# EAGLE design PowerBoard (EAGLE 9.2.2)

## Sheet 1 of 3
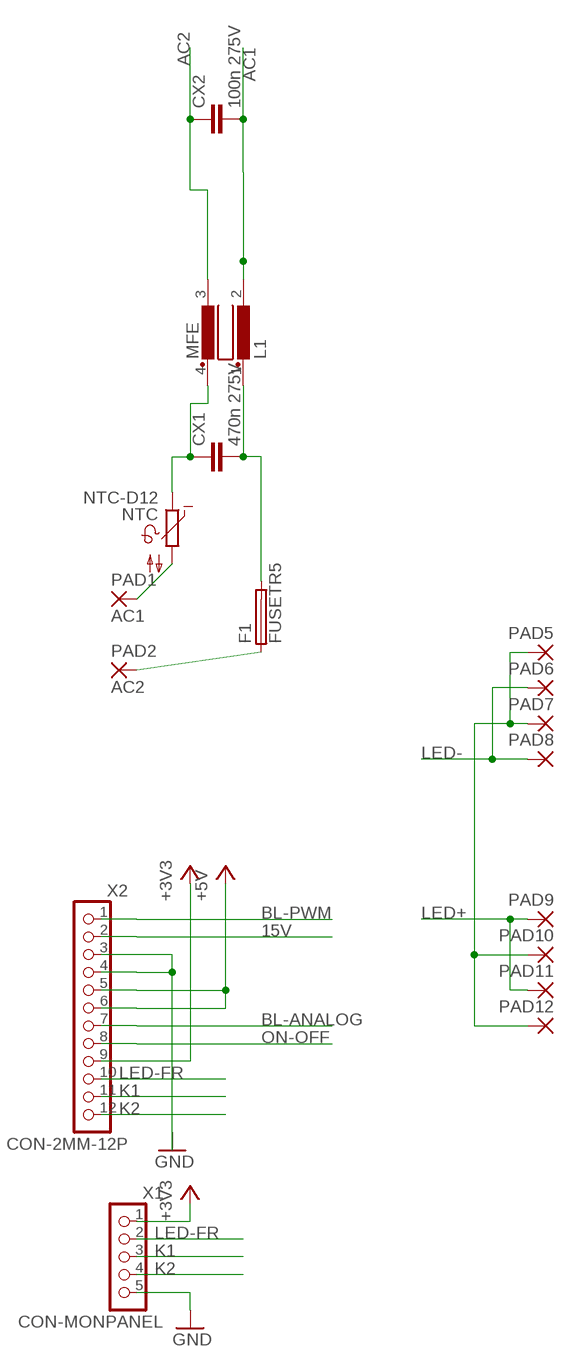
[diagram p0: schematic, sheet 1]

### Parts
CX1  470n 275V  CXXC15B10  [XC15B10]
CX2  100n 275V  CXXC15B6  [XC15B6]
F1  FUSETR5  [TR5]
L1  MFE  [MFE]
NTC  NTC-D12  [NTC-D12]
PAD1  AC1  WIREPAD3,81/1,4  [3,81/1,4]
PAD2  AC2  WIREPAD3,81/1,4  [3,81/1,4]
PAD5  2,54/1,1  [2,54/1,1]
PAD6  2,54/1,1  [2,54/1,1]
PAD7  2,54/1,1  [2,54/1,1]
PAD8  2,54/1,1  [2,54/1,1]
PAD9  2,54/1,1  [2,54/1,1]
PAD10  2,54/1,1  [2,54/1,1]
PAD11  2,54/1,1  [2,54/1,1]
PAD12  2,54/1,1  [2,54/1,1]
X1  CON-MONPANEL  [CON-5-PANEL]
X2  CON-2MM-12P  [CON-12-2MM]

### Nets
15V: X2.2
+3V3: X1.1 X2.9
+5V: X2.5 X2.6 ; also sheet 3
AC1: CX2.2 L1.2 ; also sheet 2,3
AC2: CX2.1 L1.3 ; also sheet 2,3
BL-ANALOG: X2.7
BL-PWM: X2.1 ; also sheet 2
GND: X1.5 X2.3 X2.4 ; also sheet 2,3
K1: X1.3 X2.11
K2: X1.4 X2.12
LED+: PAD9.1(P) PAD11.1(P) ; also sheet 2
LED-: PAD6.1(P) PAD8.1(P) ; also sheet 2
LED-FR: X1.2 X2.10
N$3: PAD5.1(P) PAD7.1(P) PAD10.1(P) PAD12.1(P)
N$12: NTC.2 PAD1.1(P)
N$20: F1.1 PAD2.1(P)
N$35: CX1.1 L1.4 NTC.1
N$36: CX1.2 F1.2 L1.1
ON-OFF: X2.8 ; also sheet 2

## Sheet 2 of 3
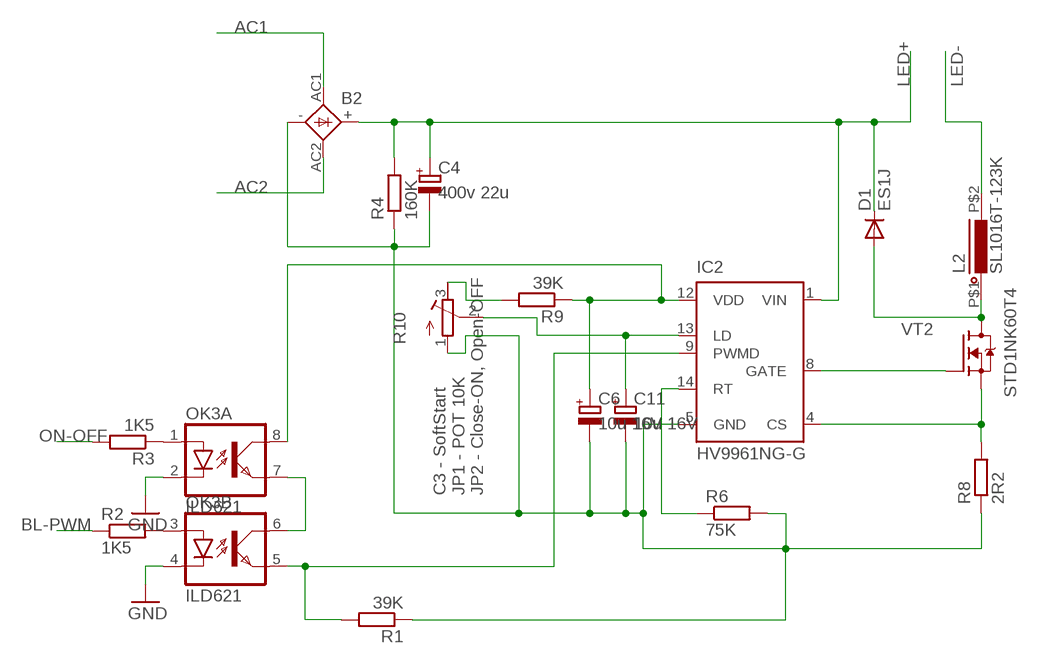
[diagram p1: schematic, sheet 2]

### Parts
B2  BRIDGEDBS  [DBS]
C4  400v 22u  CAP-POL_E5-13,5  [E5-13,5]
C6  10u 16V  CAP-POL_E2.5-7  [E2,5-7]
C11  10u 16V  CAP-POL_E2.5-7  [E2,5-7]
D1  ES1J  DIODE_ES1J  [DO214AC]
IC2  HV9961NG-G  HV9910BNG  [SOIC-16NG]
L2  SL1016T-123K  INDUCTORSL1016  [SL1016]
OK3  ILD621  [DIL08]
R1  39K  R_R0805  [RESC2012X50]
R2  1K5  R_R0805  [RESC2012X50]
R3  1K5  R_R0805  [RESC2012X50]
R4  160K  R_MF-0125  [MF-0125]
R6  75K  R_R0805  [RESC2012X50]
R8  2R2  R_MF-05  [MF-05]
R9  39K  R_R0805  [RESC2012X50]
R10  R_POT3296X  [POT-3296X]
VT2  STD1NK60T4  FET-NDPAK  [DPAK]

### Nets
AC1: B2.AC1 ; also sheet 1,3
AC2: B2.AC2 ; also sheet 1,3
BL-PWM: R2.1 ; also sheet 1
GND: OK3.2(A:C) OK3.4(B:C) ; also sheet 1,3
LED+: B2.+ C4.+ D1.C IC2.1(VIN) R4.2 ; also sheet 1
LED-: L2.P$2 ; also sheet 1
N$6: OK3.6(B:COL) OK3.7(A:EMIT)
N$7: IC2.9(PWMD) OK3.5(B:EMIT) R1.2
N$8: OK3.1(A:A) R3.1
N$9: OK3.3(B:A) R2.2
N$10: IC2.14(RT) R6.1
N$11: IC2.8(GATE) VT2.1(G)
N$18: D1.A L2.P$1 VT2.2(PAD)(D)
N$24: IC2.4(CS) R8.2 VT2.3(S)
N$25: B2.- C4.- C6.- C11.- IC2.5(GND) R1.1 R4.1 R6.2 R8.1 R10.1(A)
N$26: C11.+ IC2.13(LD) R10.2(S)
N$27: R9.2 R10.3(E)
N$29: C6.+ IC2.12(VDD) OK3.8(A:COL) R9.1
ON-OFF: R3.2 ; also sheet 1

### Notes on the sheet
- C3 - SoftStart
  JP1 - POT 10K
  JP2 - Close-ON, Open-OFF

## Sheet 3 of 3
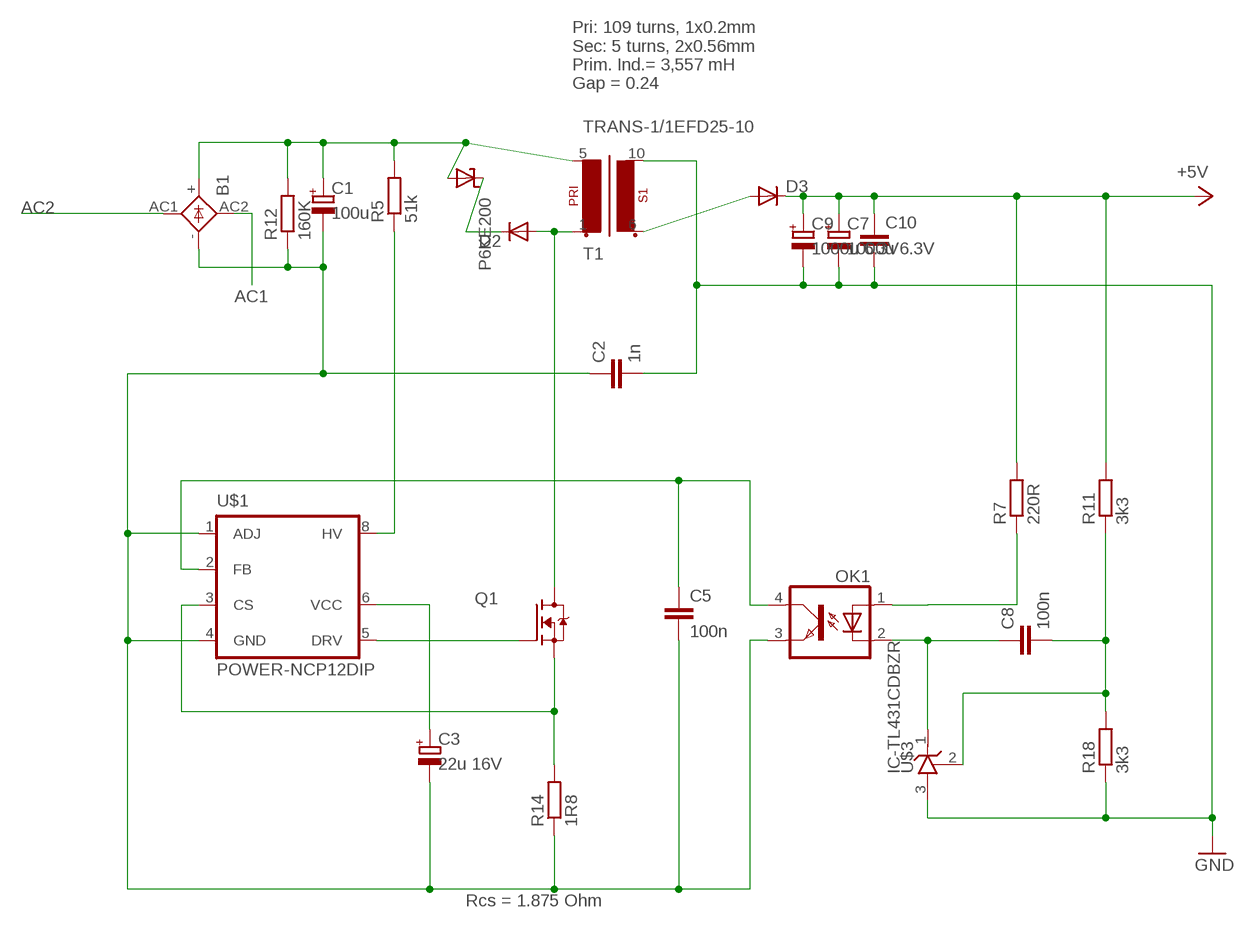
[diagram p2: schematic, sheet 3]

### Parts
B1  KBL  [KBL]
C1  100u  CAP-POL_E5-13-35-H  [E5-13-35-HORIZ]
C2  1n  CAP_C50-024X044  [C050-024X044]
C3  22u 16V  CAP-POL_E2.5-7  [E2,5-7]
C5  100n  CAP_1206  [CAP1206]
C7  1000u 6.3V  CAP-POL_E3.5-8  [E3,5-8]
C8  100n  CAP_1206  [CAP1206]
C9  1000u 6.3V  CAP-POL_E3.5-8  [E3,5-8]
C10  CAP_0805  [CAP0805]
D2  DIODE_ES1J  [DO214AC]
D3  DIODE_TO-220-2  [TO220ACS]
OK1  OPTOTRANSPC817  [DIL04]
P6KE200  SUPRESSORDO-204AC  [DO15-12]
Q1  FET-NTO-220  [TO-220V]
R5  51k  R_SQP-5  [SQP-5]
R7  220R  R_R1206  [RESC3216X60]
R11  3k3  R_R1206  [RESC3216X60]
R12  160K  R_MF-0125  [MF-0125]
R14  1R8  R_MF-025  [MF-025]
R18  3k3  R_R1206  [RESC3216X60]
T1  TRANS-1/1EFD25-10  [EFD25_10PIN]
U$1  POWER-NCP12DIP  [DIP-8]
U$3  IC-TL431CDBZR  [SOT95P240X115-3]

### Nets
+5V: C7.+ C9.+ C10.1 D3.C R7.2 R11.2 ; also sheet 1
AC1: B1.AC2(AC1) ; also sheet 1,2
AC2: B1.AC1(AC2) ; also sheet 1,2
GND: C2.2 C7.- C9.- C10.2 R18.1 T1.10(S1-2) U$3.3(A) ; also sheet 1,2
N$13: B1.+ C1.+ P6KE200.A R5.2 R12.2 T1.5(P1-2)
N$14: D2.A Q1.2(D) T1.1(P1-1)
N$15: R5.1 U$1.8(HV)
N$16: C3.+ U$1.6(VCC)
N$17: C5.1 OK1.4(COL) U$1.2(FB)
N$19: D2.C P6KE200.C
N$21: OK1.1(A) R7.1
N$22: Q1.1(G) U$1.5(DRV)
N$23: C8.2 R11.1 R18.2 U$3.2(R)
N$30: B1.- C1.- C2.1 C3.- C5.2 OK1.3(EMIT) R12.1 R14.1 U$1.1(ADJ) U$1.4(GND)
N$31: C8.1 OK1.2(C) U$3.1(C)
N$33: Q1.3(S) R14.2 U$1.3(CS)
N$41: D3.A T1.6(S1-1)

### Notes on the sheet
- Pri: 109 turns, 1x0.2mm
  Sec: 5 turns, 2x0.56mm
  Prim. Ind.= 3,557 mH
  Gap = 0.24
- Rcs = 1.875 Ohm

## Library data of the parts
B1 = rectifier:KBL: DIOTEC RECTIFIER
B2 = Flamberm:BRIDGE: GENERAL INSTRUMENT RECTIFIER
C1 C3 C4 C6 C7 C9 C11 = Flamberm:CAP-POL_
C2 C5 C8 C10 = Flamberm:CAP_
CX1 CX2 = rcl:CX: X CAPACITOR for power line; SPICEPREFIX: C
D1-D3 = Flamberm:DIODE_
F1 = fuse:FUSE: Fuse; OC_FARNELL: unknown; OC_NEWARK: unknown
IC2 = Flamberm:HV9910B: Universal High Brightness LED Driver Source: www.supertex.com .. led_driver_ics_SG.pdf; OC_FARNELL: unknown; OC_NEWARK: unknown
L1 = inductors:MFE: FILTER
L2 = Flamberm:INDUCTOR
NTC = Flamberm:NTC-D12
OK1 = Flamberm:OPTOTRANS: SHARP OPTO COUPLER; MPN: PC817X4J000F; OC_FARNELL: 9707727; OC_NEWARK: 97K7059
OK3 = optocoupler:ILD621: SIEMENS OPTO COUPLER; MF: VISHAY/TELEFUNKEN; MPN: ILD621; OC_FARNELL: 1020151; OC_NEWARK: 58K1678
P6KE200 = Flamberm:SUPRESSOR
PAD1 PAD2 = wirepad:WIREPAD: Wire PAD connect wire on PCB
PAD5-PAD12 = wirepad:2,54/1,1: THROUGH-HOLE PAD
Q1 VT2 = Flamberm:FET-N
R1-R9 R11 R12 R14 R18 = Flamberm:R_
R10 = Flamberm:R_POT
T1 = Flamberm:TRANS-1/1
U$1 = Flamberm:POWER-NCP12*
U$3 = Flamberm:IC-TL431
X1 = Flamberm:CON-MONPANEL
X2 = Flamberm:CON-2MM-12P

## Board
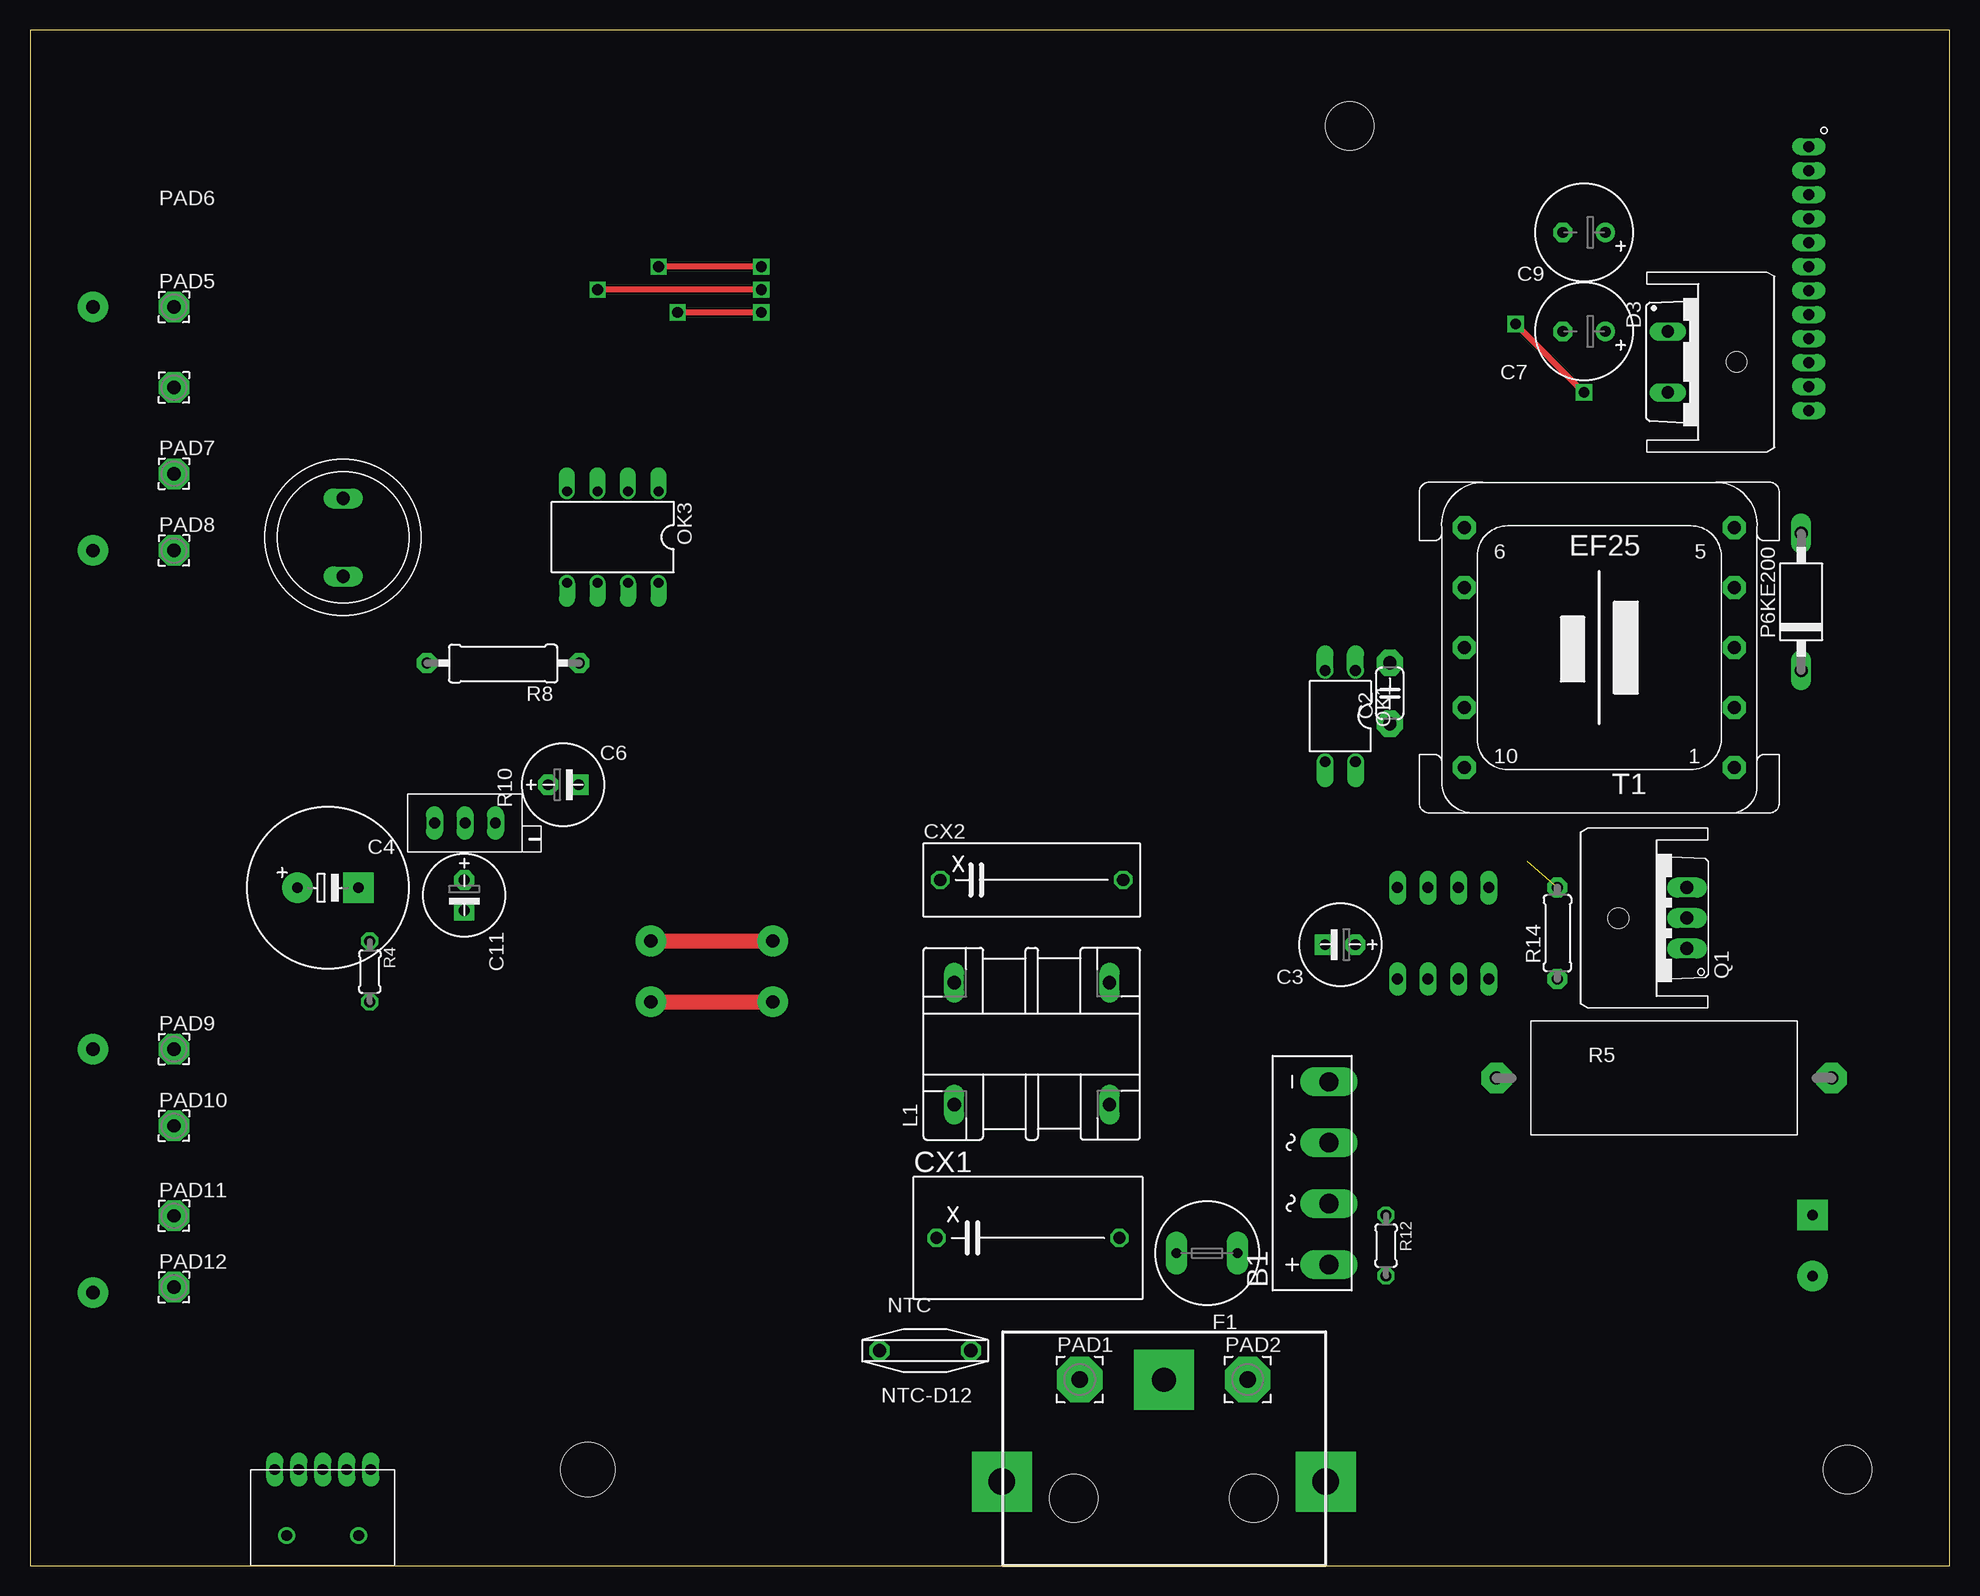
[diagram p3: board, top side]
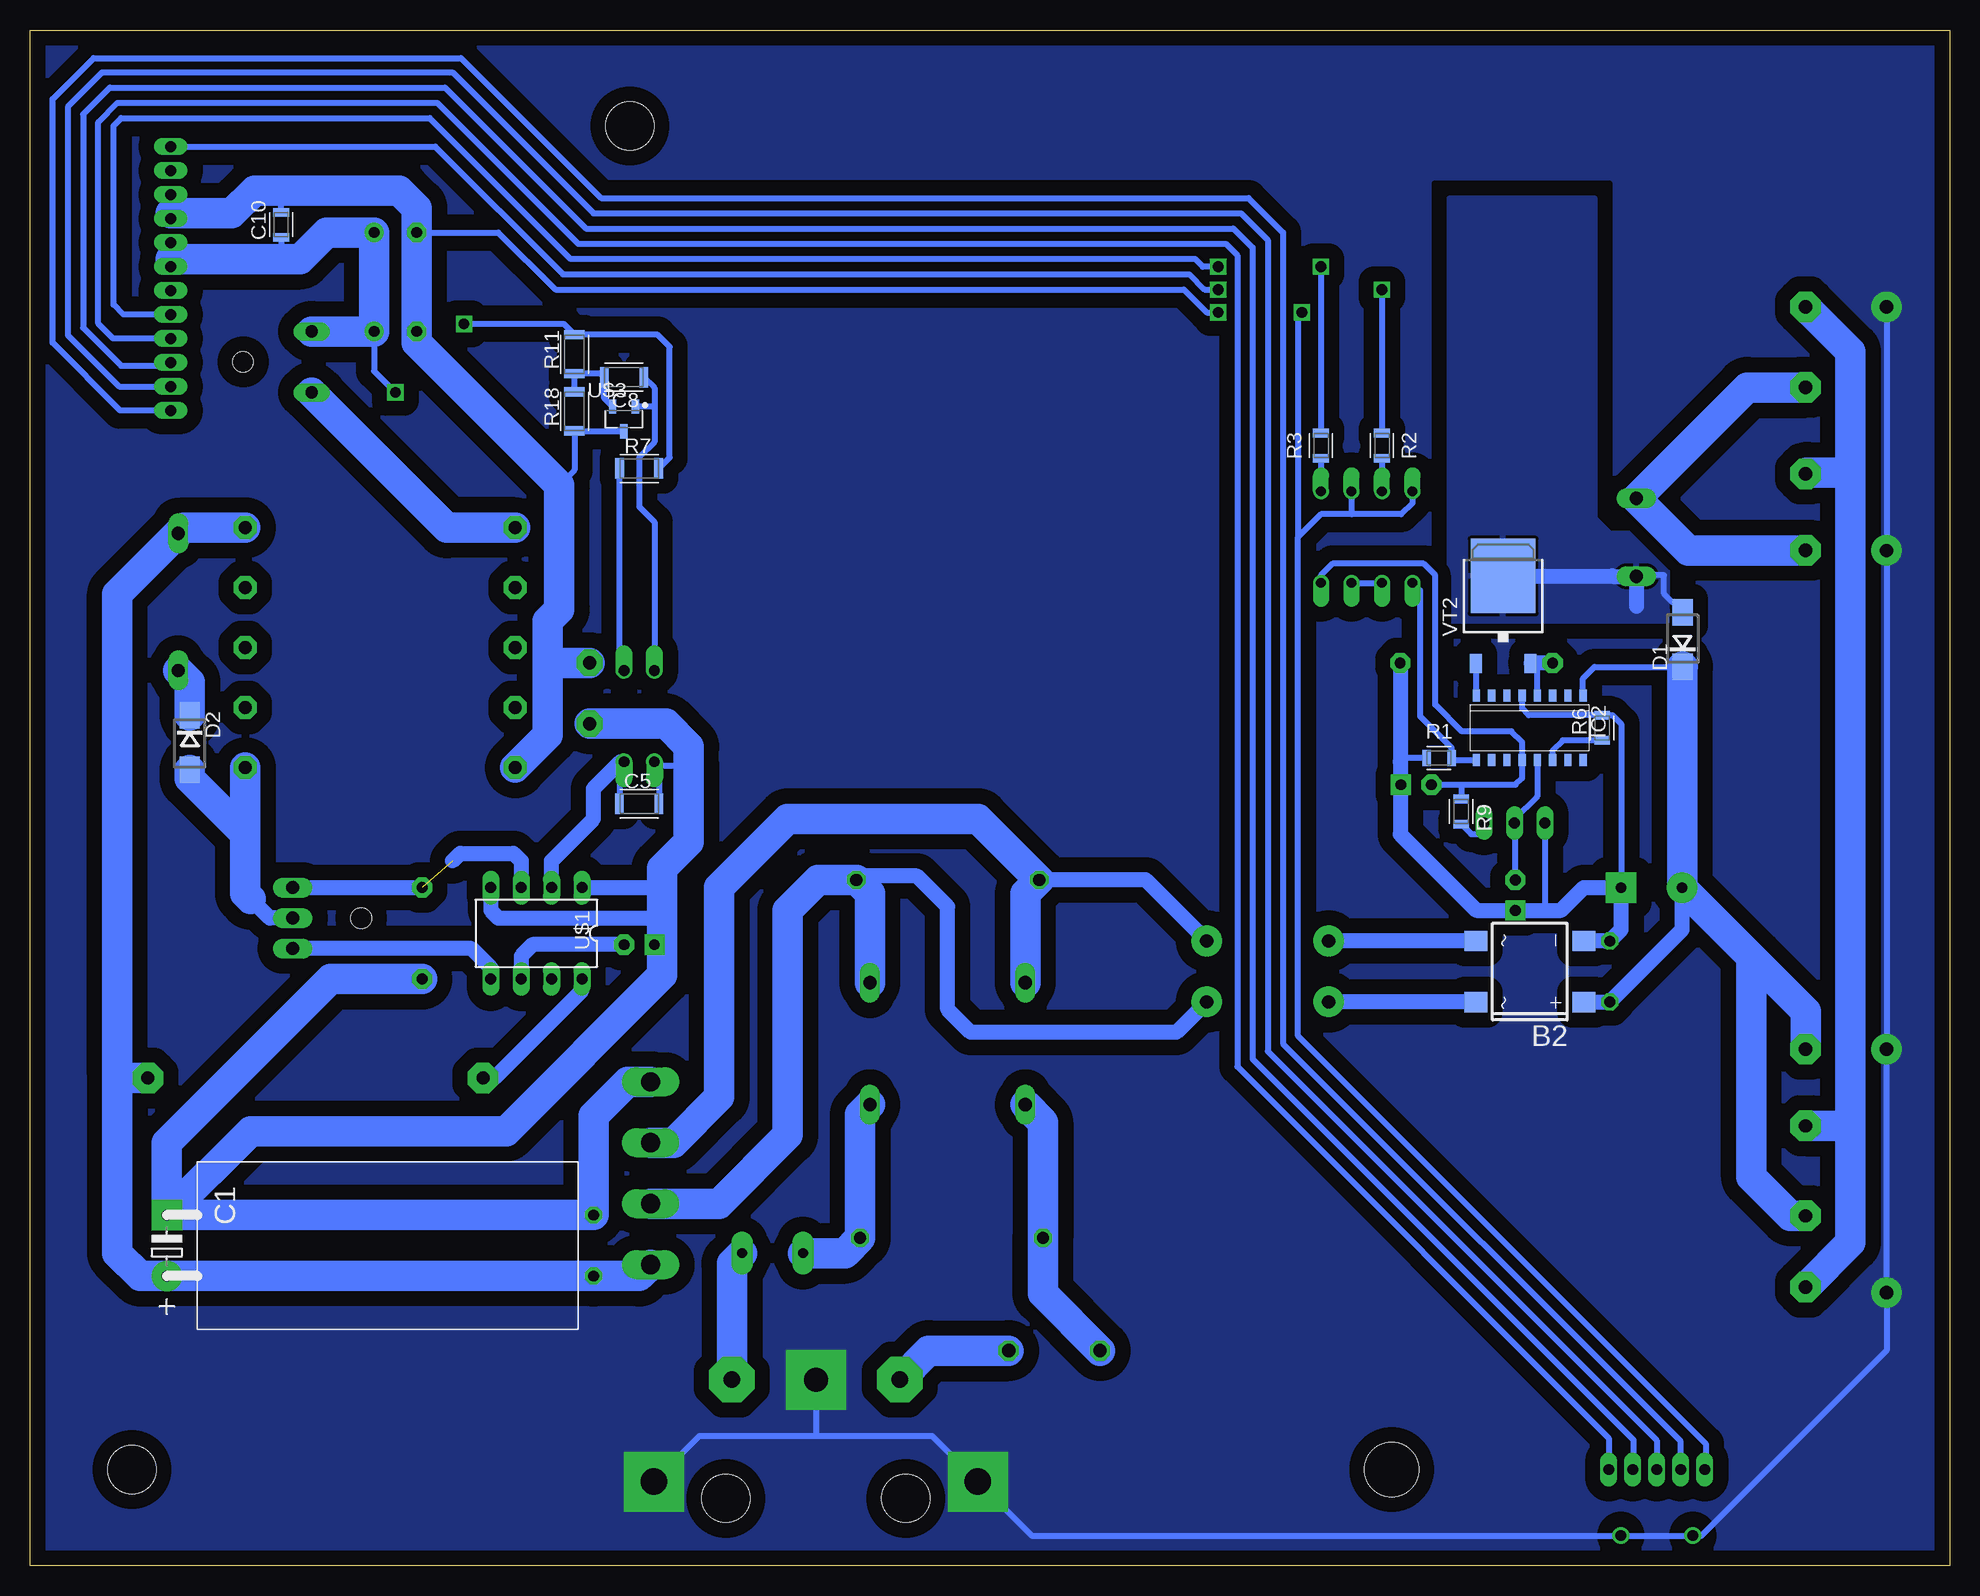
[diagram p4: board, bottom side, seen from below]

Size 160 x 128 mm. Coordinates in mm from the lower left corner, seen from the top.
Outline: 0,0 160,0 160,128 0,128 0,0
Copper layers (1*16): Top 0.035mm / dielectric 1.5mm / Bottom 0.035mm
Design rules "EagleDesignRules": minimum track width 0.25mm, minimum drill 0.3mm, track to track 0.25mm, track to pad 0.25mm, pad to pad 0.25mm, via to via 0.25mm, smd to smd 0.25mm, copper to edge 0.5mm, drill to drill 0.5mm, minimum pad ring 10mil, minimum via ring 8mil, stop-mask expansion 4mil, vias tented up to drill 0mil, thermal gap 0.25mm
Holes 4.5 mm at 46.5,8
Holes 4 mm at 151.5,8 110,120 87,5.6 102,5.6

### Footprints (pad centres in the part's own frame; a part is rotated, then mirrored left to right if it is on the bottom)
KBL = drill 1.6 long: + -7.62,-1.27; - 7.62,-1.27; AC1 2.54,-1.27; AC2 -2.54,-1.27
DBS = smd 1.7 x 1.9: + -2.55,-4.5; - 2.55,-4.5; AC1 -2.55,4.5; AC2 2.55,4.5
E5-13-35-HORIZ = drill 0.9 pad 2.54: + -2.54,0 | drill 0.9 pad 2.54 square: - 2.54,0
C050-024X044 = drill 1.1 pad 2.184 octagon: 1 -2.54,0; 2 2.54,0
E2,5-7 = drill 0.9 pad 1.676 octagon: + -1.27,0 | drill 0.9 pad 1.676 square: - 1.27,0
E5-13,5 = drill 0.9 pad 2.54: + -2.54,0 | drill 0.9 pad 2.54 square: - 2.54,0
CAP1206 = smd 0.712 x 1.712: 1 -1.65,0; 2 1.65,0
E3,5-8 = drill 0.9 pad 1.6: + -1.778,0 | drill 0.9 pad 1.6 octagon: - 1.778,0
CAP0805 = smd 0.712 x 1.312: 1 -1.05,0; 2 1.05,0
XC15B10 = drill 1.016 octagon: 1 -7.62,0; 2 7.62,0
XC15B6 = drill 1.016 octagon: 1 -7.62,0; 2 7.62,0
DO214AC = smd 2.2 x 1.7: A 2.25,0; C -2.285,0
TO220ACS = drill 1.016 long: A 2.54,-2.54; C -2.54,-2.54
TR5 = drill 0.813 pad 1.778 long: 1 -2.54,0; 2 2.54,0
SOIC-16NG = smd 0.6 x 1: 1 -4.445,-2.675; 2 -3.175,-2.675; 3 -1.905,-2.675; 4 -0.635,-2.675; 5 0.635,-2.675; 6 1.905,-2.675; 7 3.175,-2.675; 8 4.445,-2.675; 9 4.445,2.675; 10 3.175,2.675; 11 1.905,2.675; 12 0.635,2.675; 13 -0.635,2.675; 14 -1.905,2.675; 15 -3.175,2.675; 16 -4.445,2.675
MFE = drill 1.118 long: 1 6.477,-5.08; 2 6.477,5.08; 3 -6.477,5.08; 4 -6.477,-5.08
SL1016 = drill 1.1 long: P$1 3.25,0; P$2 -3.25,0
NTC-D12 = drill 1.1 pad 1.676 octagon: 1 -3.81,0; 2 3.81,0
DIL04 = drill 0.9 pad 1.27 offset: 1 -1.27,-3.81; 2 1.27,-3.81; 3 1.27,3.81; 4 -1.27,3.81
DIL08 = drill 0.813 offset: 1 -3.81,-3.81; 2 -1.27,-3.81; 3 1.27,-3.81; 4 3.81,-3.81; 5 3.81,3.81; 6 1.27,3.81; 7 -1.27,3.81; 8 -3.81,3.81
DO15-12 = drill 1.1 pad 1.676 long: A 5.08,0; C -6.35,0
3,81/1,4 = drill 1.397 pad 3.81 octagon: 1 0,0
2,54/1,1 = drill 1.118 pad 2.54 octagon: 1 0,0
TO-220V = drill 1.1 long: 1 -2.54,-2.54; 2 0,-2.54; 3 2.54,-2.54
RESC2012X50 = smd 0.712 x 1.312: 1 -1.05,0; 2 1.05,0
MF-0125 = drill 0.9 octagon: 1 -2.54,0; 2 2.54,0
SQP-5 = drill 1.1 pad 2.54 octagon: 1 -13.97,0; 2 13.97,0
RESC3216X60 = smd 0.762 x 1.712: 1 -1.625,0; 2 1.625,0
MF-05 = drill 0.9 pad 1.676 octagon: 1 -6.35,0; 2 6.35,0
POT-3296X = drill 0.9 long: 1 0,-2.54; 2 0,0; 3 0,2.54
MF-025 = drill 0.9 pad 1.676 octagon: 1 -3.81,0; 2 3.81,0
EFD25_10PIN = drill 1.1 pad 1.93 octagon: 1 -11.25,10; 2 -11.25,5; 3 -11.25,0; 4 -11.25,-5; 5 -11.25,-10; 6 11.25,-10; 7 11.25,-5; 8 11.25,0; 9 11.25,5; 10 11.25,10
DIP-8 = drill 0.9 long: 1 -3.81,-3.81; 2 -1.27,-3.81; 3 1.27,-3.81; 4 3.81,-3.81; 5 3.81,3.81; 6 1.27,3.81; 7 -1.27,3.81; 8 -3.81,3.81
SK95-3M3_HOLE = hole 1.7: 0,3.175
SOT95P240X115-3 = smd 1.18 x 0.609: 1 -1.024,0.95; 2 -1.024,-0.95; 3 1.024,0
DPAK = smd 1 x 1.6: 1 -2.28,-4.8; 3 2.28,-4.8 | smd 5.4 x 6.2: 2(PAD) 0,2.5
CON-5-PANEL = drill 0.9 long: 1 4,0; 2 2,0; 3 0,0; 4 -2,0; 5 -4,0 | drill 0.9: P$6 3,-5.5; P$7 -3,-5.5
CON-12-2MM = drill 0.9 long: 1 -10.968,0; 2 -8.968,0; 3 -6.968,0; 4 -4.968,0; 5 -2.968,0; 6 -0.968,0; 7 1.032,0; 8 3.032,0; 9 5.032,0; 10 7.032,0; 11 9.032,0; 12 11.032,0

### Placement (x,y rotation side)
B1  107,32.7 90 top
B2  34.99,49.51 90 bottom
C1  148.59,26.67 90 bottom
C2  113.35,72.71 90 top
C3  109.22,51.75 180 top
C4  24.83,56.49 0 top
C5  109.22,63.5 0 bottom
C6  44.45,65.09 0 top
C7  129.54,102.87 180 top
C8  110.49,99.06 180 bottom
C9  129.54,111.12 180 top
C10  139.06,111.76 90 bottom
C11  36.2,55.88 270 top
CX1  83.19,27.3 0 top
CX2  83.5,57.15 0 top
D1  22.25,77.22 90 bottom
D2  146.69,68.58 270 bottom
D3  139.06,100.33 270 top
F1  98.11,26.04 180 top
IC2  34.99,69.83 180 bottom
L1  83.5,43.5 0 top
L2  26.1,85.7 270 top
NTC  74.61,17.91 0 top
OK1  109.22,70.8 180 top
OK3  48.58,85.72 180 top
P6KE200  147.64,80.96 90 top
PAD1  87.5,15.5 0 top
PAD2  101.5,15.5 0 top
PAD5  12,104.92 0 top
PAD6  12,98.2 0 top
PAD7  12,91.02 0 top
PAD8  12,84.61 0 top
PAD9  12,43.05 0 top
PAD10  12,36.65 0 top
PAD11  12,29.15 0 top
PAD12  12,23.2 0 top
Q1  135.57,53.98 90 top
R1  42.55,67.31 0 bottom
R2  47.31,93.34 270 bottom
R3  52.39,93.34 90 bottom
R4  28.32,49.51 270 top
R5  136.21,40.64 0 top
R6  28.96,69.83 90 bottom
R7  109.22,91.44 0 bottom
R8  39.44,75.23 180 top
R9  40.7,62.84 270 bottom
R10  36.26,61.89 270 top
R11  114.62,100.97 90 bottom
R12  113.03,26.67 270 top
R14  127.32,52.7 90 top
R18  114.62,96.2 90 bottom
T1  130.81,76.52 180 top
U$1  117.79,52.7 180 bottom
U$2  [SK95-3M3_HOLE]  135.57,53.98 90 top
U$3  110.49,95.57 270 bottom
U$4  [SK95-3M3_HOLE]  139.06,100.33 270 top
VT2  37.21,79.99 0 bottom
X1  24.4,8 0 top
X2  148.27,107.31 270 top

### Tracks (layer width: path | path; a pad name or v marks a point on that pad's centre or on a via)
+3V3
  Bottom 0.508: X2.9 153.08,102.28 154.31,103.5 154.31,120.33 152.72,121.92 126.05,121.92 114.3,110.17 60.33,110.17 59.37,109.22 59.37,41.59 28.4,10.62 X1.1
+5V  (via drill 0.9 pad 1.3)
  Top 0.508: v129.54,97.79 v123.83,103.5
  Bottom 0.508: C10.1 139.06,109.22 139.38,108.9 | R7.2 106.68,92.36 106.68,101.6 107.67,102.59 R11.2 115.53,103.5 v123.83,103.5 | C7.+ 131.32,99.57 v129.54,97.79
  Bottom 1.27: X2.5 148.27,108.9 X2.6
  Bottom 2.54: D3.C C7.+ C9.+ 135.25,111.12 137.48,108.9 139.38,108.9 148.27,108.9
AC1  (via drill 1.1 pad 2.56)
  Top 1.27: v51.75,46.99 v61.91,46.99
  Bottom 1.27: v61.91,46.99 64.45,44.45 81.6,44.45 83.5,46.35 83.5,54.93 86.04,57.47 90.81,57.47 CX2.2 | v51.75,46.99 51.72,46.96 B2.AC1
  Bottom 2.54: L1.2 89.98,56.01 CX2.2 94.3,57.15 96.84,54.61 96.84,35.88 102.55,30.16 B1.AC2
AC2  (via drill 1.1 pad 2.56)
  Top 1.27: v51.75,52.07 v61.91,52.07
  Bottom 1.27: B2.AC2 v51.74,52.06 v51.75,52.07 | CX2.1 66.99,57.15 v61.91,52.07
  Bottom 2.54: L1.3 77.03,56.01 CX2.1 80.96,62.23 96.84,62.23 102.55,56.52 102.55,39.05 106.36,35.24 B1.AC1
BL-PWM  (via drill 0.9 pad 1.3)
  Top 0.508: v60.96,106.36 v47.31,106.36
  Bottom 0.508: X2.1 126.22,118.28 115.57,107.63 63.37,107.63 62.1,106.36 v60.96,106.36 | v47.31,106.36 R2.1
GND  (via drill 0.9 pad 1.3)
  Top 0.508: v60.96,104.46 v53.98,104.46
  Bottom 0.508: OK3.4 44.77,88.58 45.72,87.63 49.85,87.63 | R18.1 114.94,94.58 | C10.2 139.06,114.3 138.75,114.62 | R18.1 114.62,94.3 | R18.1 114.62,91.31 115.89,90.04 | C9.- 120.97,111.12 116.2,106.36 63.82,106.36 61.91,104.46 v60.96,104.46 | X1.5 20.32,8.08 20.32,10.16 54.29,44.13 54.29,85.72 | R18.1 110.53,94.58 U$3.3 | 49.85,87.63 52.39,87.63 54.29,85.72 | OK3.2 49.85,87.63 | v53.98,104.46 54.29,104.14 54.29,85.72
  Bottom 1.27: X2.4 148.27,112.71 X2.3
  Bottom 2.54: T1.10 116.84,69.24 116.84,74.93 | 148.27,112.71 143.19,112.71 141.29,114.62 138.75,114.62 129.22,114.62 127.76,113.16 C9.- C7.- 127.76,101.92 115.89,90.04 115.89,79.69 116.84,78.74 116.84,74.93 | C2.2 116.52,75.25 116.84,74.93
GROUND  (via drill 1.1 pad 2.56, 2 pad 5, 2.2 pad 5)
  Bottom 0.508: v108,7 104.2,10.79 94.61,10.79 | 94.61,10.79 84.8,10.79 v81,7 76.46,2.46 20.72,2.46 5.25,17.93 v5.25,22.75 v5.25,43.05 v5.25,84.61 v5.25,104.92 | v94.5,15.5 94.5,10.91 94.61,10.79
  pour Bottom (isolate 1.27, rank 6): 0,128.27 160.02,128.27 160.02,-0.64 -0.32,-0.64 -0.32,127.95 -0.32,128.27
K1
  Bottom 0.508: X2.11 152.58,98.28 156.84,102.55 156.84,121.6 153.99,124.46 124.78,124.46 113.03,112.71 59.05,112.71 56.83,110.49 56.83,42.86 24.4,10.43 X1.3
K2
  Bottom 0.508: X2.12 152.48,96.28 158.12,101.92 158.12,122.24 154.69,125.66 124.07,125.66 112.39,113.98 58.42,113.98 55.56,111.12 55.56,43.5 22.4,10.34 X1.4
LED+
  Bottom 0.508: B2.+ | IC2.1 30.55,73.96 29.59,74.91 22.29,74.91
  Bottom 1.27: B2.+ 28.33,46.96 R4.2 22.29,53 C4.+
  Bottom 2.54: PAD9.1 12,46.2 16.39,50.6 | 16.39,50.6 C4.+ 22.29,74.91 22.27,74.93 D1.C | PAD11.1 13.27,29.15 16.51,32.38 16.51,50.48 16.39,50.6
LED-
  Bottom 2.54: 26,89.06 L2.P$2 | L2.P$2 16.86,98.2 PAD6.1 | PAD8.1 21.76,84.61 L2.P$2
LED-FR
  Bottom 0.508: X2.10 148.54,100.01 152.4,100.01 155.57,103.19 155.57,120.97 153.35,123.19 125.41,123.19 113.67,111.44 59.69,111.44 58.1,109.86 58.1,42.23 26.35,10.48 26.35,8.05 X1.2
N$3
  Bottom 2.54: PAD5.1 8.26,101.17 8.26,91.12 | PAD12.1 8.26,26.94 8.26,36.51 | 8.26,91.12 8.26,36.51 | PAD10.1 8.39,36.65 8.26,36.51 | PAD7.1 11.89,91.12 8.26,91.12
N$6
  Bottom 0.508: OK3.7 OK3.6
N$7
  Bottom 0.508: IC2.9 41.34,67.16 R1.2 41.49,68.17 44.13,70.8 44.13,81.28 OK3.5
N$8
  Bottom 0.508: R3.1 OK3.1
N$9
  Bottom 0.508: R2.2 OK3.3
N$10
  Bottom 0.508: R6.1 32.23,68.78 33.09,67.92 IC2.14
N$11
  Bottom 0.508: IC2.8 39.44,75.13 VT2.1
N$12
  Bottom 2.54: PAD1.1 85.09,17.91 NTC.2
N$13
  Bottom 2.54: 152.72,40.96 152.72,80.96 P6KE200.A 147.16,86.52 T1.5 | R5.2 152.4,40.64 152.72,40.96 | B1.+ 109.22,24.13 R12.2 C1.+ 150.81,24.13 152.72,26.04 152.72,40.96
N$14
  Bottom 1.27: Q1.2 140.02,53.98 141.6,55.56 141.6,59.05
  Bottom 2.54: T1.1 142.06,60.96 | 142.06,60.96 142.06,56.02 141.6,55.56 | D2.A 146.69,65.58 142.06,60.96
N$15
  Bottom 1.27: U$1.8 113.98,47.94 121.28,40.64 R5.1
N$16
  Bottom 1.27: C3.+ 118.11,51.75 119.06,50.8 U$1.6
N$17
  Bottom 0.508: 110.87,63.18 C5.1 110.87,66.61 OK1.4
  Bottom 1.27: U$1.2 116.52,58.74 113.03,62.23 113.03,64.77 110.81,66.99 OK1.4
N$18
  Bottom 0.508: D1.A 23.81,81.03 23.81,82.55 26,82.55 L2.P$1
  Bottom 1.27: 26.1,79.96 L2.P$1 28.08,82.45 28.11,82.49 VT2.2(PAD)
  pour Bottom (isolate 1.016): 23.56,78.72 41.66,78.72 41.66,113.96 29.59,113.96 29.59,87.29 28.32,86.02 23.56,86.02
N$19
  Bottom 2.54: P6KE200.C 146.69,73.66 D2.C
N$20
  Bottom 2.54: F1.1 101.5,25.18 PAD2.1
N$21
  Bottom 0.508: OK1.1 110.84,74.97 R7.1
N$22
  Bottom 1.27: U$1.5 121.6,49.85 123.19,51.44 Q1.1
N$23
  Bottom 0.508: R18.2 R11.1 112.42,99.34 C8.2 112.14,97.29 U$3.2
N$24
  Bottom 0.406: 34.9,75.23 VT2.3
  Bottom 0.508: IC2.4 34.35,74.61 VT2.3
  Bottom 1.27: R8.2 34.9,75.23
N$25
  Bottom 0.508: R4.1 28.49,52.22 28.65,52.06 | IC2.5 35.62,71.42 35.09,70.88 R6.2 28.1,70.88 27.37,70.15 C4.- | 33.72,62.21 R10.1 33.72,54.67 33.66,54.61 | R1.1 45.47,67.31 45.78,66.99 | C6.- 45.78,65.09
  Bottom 1.27: R8.1 45.78,66.99 45.78,65.09 45.78,60.94 39.45,54.61 C11.- 33.66,54.61 32.38,54.61 30.48,56.52 27.39,56.52 C4.- 27.37,53 R4.1 | 28.65,52.06 B2.-
N$26
  Bottom 0.508: R10.2 36.26,62.21 34.35,64.11 IC2.13 | R10.2 36.26,61.58 | C11.+ 36.2,61.83 R10.2
N$27
  Bottom 0.508: R9.2 39.87,60.96 39.05,60.96 39.05,61.64 R10.3
N$29
  Bottom 0.508: OK3.8 52.39,82.55 51.44,83.5 43.81,83.5 42.86,82.55 42.86,71.75 40.64,69.53 36.51,69.53 35.62,68.64 IC2.12 35.62,65.64 36.18,65.09 40.64,65.09 | C6.+ 40.64,65.09 | R9.1 40.64,63.96 40.64,65.09
N$30
  Bottom 0.508: C5.2 107.57,66.61 OK1.3 107.63,66.67 105.09,66.67
  Bottom 1.27: U$1.1 107.31,56.52 | C3.- 107.31,51.75 | U$1.4 121.6,54.61 120.97,53.98 107.31,53.98
  Bottom 2.54: R14.1 134.94,48.9 148.59,35.24 C1.- | C2.1 107,70.17 105.09,68.26 105.09,66.67 105.09,60.33 107.31,58.1 107.31,56.52 107.31,53.98 107.31,51.75 107.31,49.21 120.33,36.2 141.6,36.2 C1.- | C1.- R12.1 113.03,37.47 110.17,40.32 B1.-
N$31
  Bottom 0.508: C8.1 107.95,98.17 107.95,96.52 | OK1.2 107.95,87 109.22,88.27 109.22,92.39 107.95,93.66 107.95,96.52 | 107.95,96.52 108.02,96.59 U$3.1
N$33  (1 unrouted)
  Bottom 1.27: Q1.3 R14.2 | 124.78,58.74 124.14,59.37 119.7,59.37 119.06,58.74 U$1.3
N$35
  Bottom 2.54: NTC.1 75.56,22.67 CX1.1 75.56,36.96 L1.4
N$36
  Bottom 2.54: L1.1 90.81,37.59 CX1.2 92.08,26.04 F1.2
N$41
  Bottom 2.54: T1.6 125.25,86.52 D3.A
ON-OFF  (via drill 0.9 pad 1.3)
  Top 0.508: v60.96,108.27 v52.39,108.27
  Bottom 0.508: X2.8 152.23,104.28 153.03,105.09 153.03,120.02 152.4,120.65 126.68,120.65 114.94,108.9 62.87,108.9 62.23,108.27 v60.96,108.27 | v52.39,108.27 R3.2